# EAGLE schematic PCB (EAGLE 9.2.0)

## Sheet 1 of 5: PCB Power Regulation
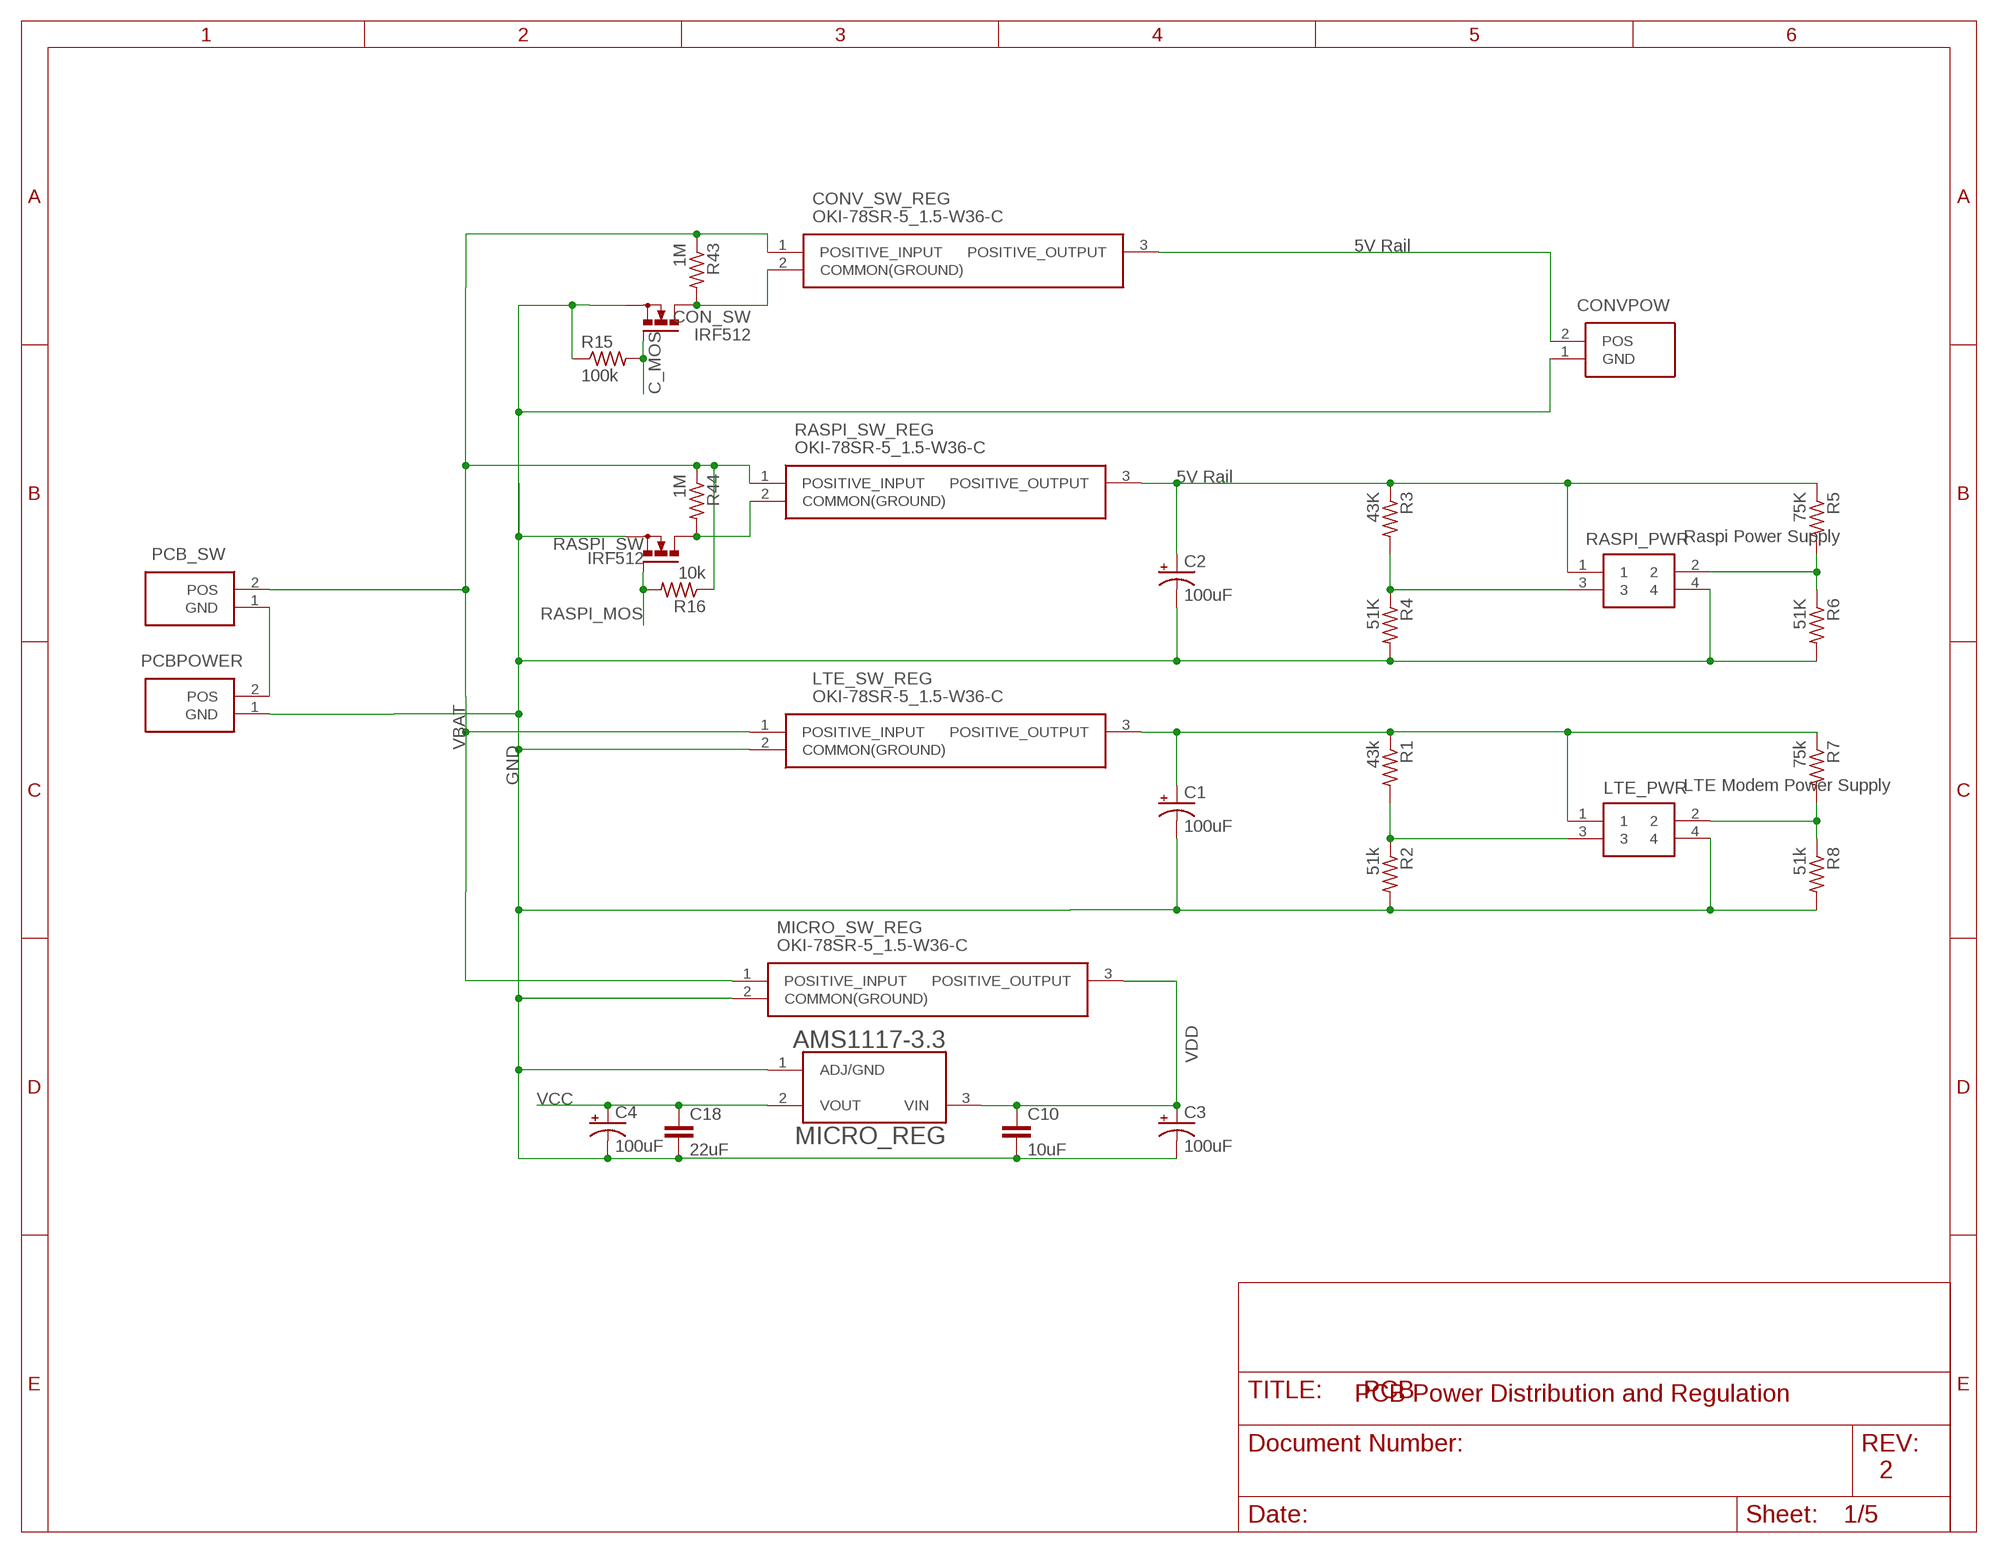
[diagram p0: schematic, sheet 1]
PCB (FRAME_A_L): REV: 2; TITLE: PCB Power Distribution and Regulation

### Parts
C1  100uF  CPOL-US140CLH-0810  [140CLH-0810]
C2  100uF  CPOL-US140CLH-0810  [140CLH-0810]
C3  100uF  CPOL-US140CLH-0810  [140CLH-0810]
C4  100uF  CPOL-US140CLH-0810  [140CLH-0810]
C10  10uF  C-EUC0805  [C0805]
C18  22uF  C-EUC0805  [C0805]
CON_SW  IRF512  [TO220BV]
CONV_SW_REG  OKI-78SR-5_1.5-W36-C  [OKI-78SR]
CONVPOW  PRT-10474  [SHDR2W320P716_1X2_1574X813X158]
LTE_PWR  LTE Modem Power Supply  105057-0001  [105057-0001]
LTE_SW_REG  OKI-78SR-5_1.5-W36-C  [OKI-78SR]
MICRO_REG  AMS1117-3.3  [SOT229P700X180-4N]
MICRO_SW_REG  OKI-78SR-5_1.5-W36-C  [OKI-78SR]
PCB_SW  PRT-10474  [SHDR2W320P716_1X2_1574X813X158]
PCBPOWER  PRT-10474  [SHDR2W320P716_1X2_1574X813X158]
R1  43k  R-US_R0805  [R0805]
R2  51k  R-US_R0805  [R0805]
R3  43K  R-US_R0805  [R0805]
R4  51K  R-US_R0805  [R0805]
R5  75K  R-US_R0805  [R0805]
R6  51K  R-US_R0805  [R0805]
R7  75k  R-US_R0805  [R0805]
R8  51k  R-US_R0805  [R0805]
R15  100k  R-US_R0805  [R0805]
R16  10k  R-US_R0805  [R0805]
R43  1M  R-US_R0805  [R0805]
R44  1M  R-US_R0805  [R0805]
RASPI_PWR  Raspi Power Supply  105057-0001  [105057-0001]
RASPI_SW  IRF512  [TO220BV]
RASPI_SW_REG  OKI-78SR-5_1.5-W36-C  [OKI-78SR]

### Nets
C_MOS: CON_SW.G R15.2 ; also sheet 3
GND [power]: C1.- C2.- C3.- C4.- C10.2 C18.2 CON_SW.S CONVPOW.1(GND) LTE_PWR.4 LTE_SW_REG.2(COMMON(GROUND)) MICRO_REG.1(ADJ/GND) MICRO_SW_REG.2(COMMON(GROUND)) PCBPOWER.1(GND) R2.2 R4.2 R6.2 R8.2 R15.1 RASPI_PWR.4 RASPI_SW.S ; also sheet 2,3,4
N$2 [power]: CONV_SW_REG.3(POSITIVE_OUTPUT) CONVPOW.2(POS)
N$6 [power]: C1.+ LTE_PWR.1 LTE_SW_REG.3(POSITIVE_OUTPUT) R1.1 R7.1
N$7 [power]: LTE_PWR.3 R1.2 R2.1
N$9 [power]: LTE_PWR.2 R7.2 R8.1
N$11 [power]: CON_SW.D CONV_SW_REG.2(COMMON(GROUND)) R43.2
N$13 [power]: R5.2 R6.1 RASPI_PWR.2
N$15 [power]: R3.2 R4.1 RASPI_PWR.3
N$16 [power]: C2.+ R3.1 R5.1 RASPI_PWR.1 RASPI_SW_REG.3(POSITIVE_OUTPUT)
N$19: R44.2 RASPI_SW.D RASPI_SW_REG.2(COMMON(GROUND))
N$52: PCB_SW.1(GND) PCBPOWER.2(POS)
RASPI_MOS: R16.2 RASPI_SW.G ; also sheet 3
VBAT [power]: CONV_SW_REG.1(POSITIVE_INPUT) LTE_SW_REG.1(POSITIVE_INPUT) MICRO_SW_REG.1(POSITIVE_INPUT) PCB_SW.2(POS) R16.1 R43.1 R44.1 RASPI_SW_REG.1(POSITIVE_INPUT)
VCC: C4.+ C18.1 MICRO_REG.2(VOUT) ; also sheet 3,4
VDD [power]: C3.+ C10.1 MICRO_REG.3(VIN) MICRO_SW_REG.3(POSITIVE_OUTPUT) ; also sheet 4

### Notes on the sheet
- 5V Rail
- 5V Rail

## Sheet 2 of 5: Onboard Charging Circuit
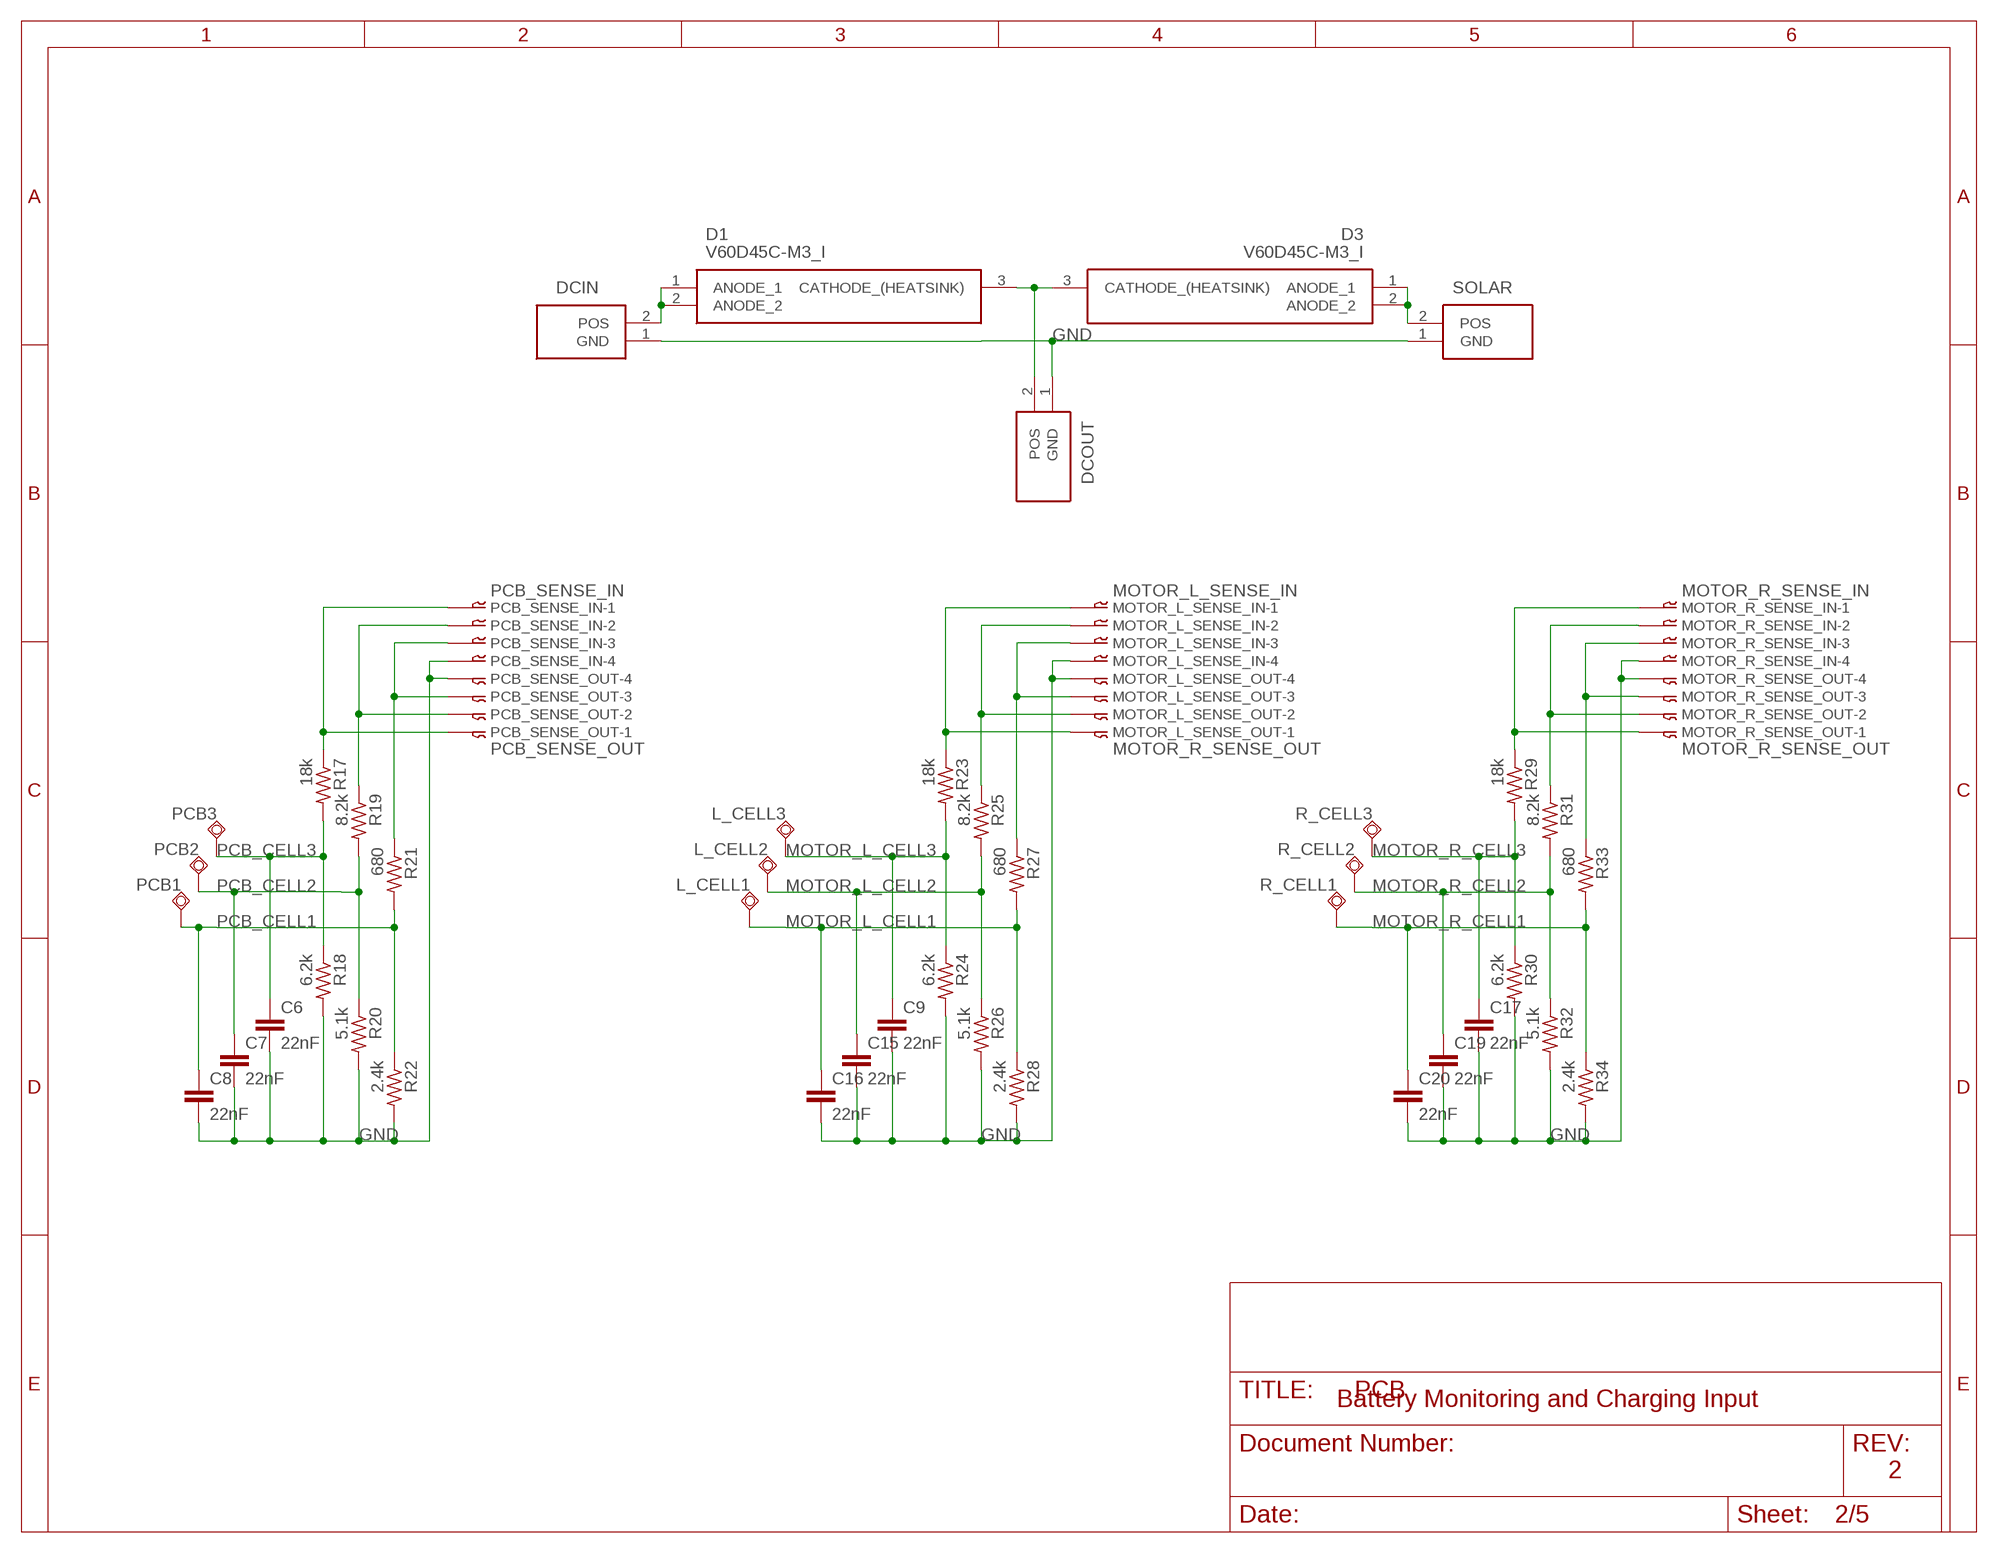
[diagram p1: schematic, sheet 2]
FRAME2 (FRAME_A_L): REVISION: 2; TITLE: Battery Monitoring and Charging Input

### Parts
C6  22nF  C  [C0805]
C7  22nF  C  [C0805]
C8  22nF  C  [C0805]
C9  22nF  C  [C0805]
C15  22nF  C  [C0805]
C16  22nF  C  [C0805]
C17  22nF  C  [C0805]
C19  22nF  C  [C0805]
C20  22nF  C  [C0805]
D1  V60D45C-M3_I  [TO-263AC(SMPD)]
D3  V60D45C-M3_I  [TO-263AC(SMPD)]
DCIN  PRT-10474  [SHDR2W320P716_1X2_1574X813X158]
DCOUT  PRT-10474  [SHDR2W320P716_1X2_1574X813X158]
L_CELL1  TPSQB2,54  [B2,54]
L_CELL2  TPSQB2,54  [B2,54]
L_CELL3  PCB_CELL3  TPSQB2,54  [B2,54]
MOTOR_L_SENSE_IN  MOTOR_L_SENSE_IN  04-JST-B4B-XH-A  [B4B-XH]
MOTOR_L_SENSE_OUT  MOTOR_R_SENSE_OUT  04-JST-B4B-XH-A  [B4B-XH]
MOTOR_R_SENSE_IN  MOTOR_R_SENSE_IN  04-JST-B4B-XH-A  [B4B-XH]
MOTOR_R_SENSE_OUT  MOTOR_R_SENSE_OUT  04-JST-B4B-XH-A  [B4B-XH]
PCB1  TPSQB2,54  [B2,54]
PCB2  TPSQB2,54  [B2,54]
PCB3  PCB_CELL3  TPSQB2,54  [B2,54]
PCB_SENSE_IN  PCB_SENSE_IN  04-JST-B4B-XH-A  [B4B-XH]
PCB_SENSE_OUT  PCB_SENSE_OUT  04-JST-B4B-XH-A  [B4B-XH]
R17  18k  R-US_R0805  [R0805]
R18  6.2k  R-US_R0805  [R0805]
R19  8.2k  R-US_R0805  [R0805]
R20  5.1k  R-US_R0805  [R0805]
R21  680  R-US_R0805  [R0805]
R22  2.4k  R-US_R0805  [R0805]
R23  18k  R-US_R0805  [R0805]
R24  6.2k  R-US_R0805  [R0805]
R25  8.2k  R-US_R0805  [R0805]
R26  5.1k  R-US_R0805  [R0805]
R27  680  R-US_R0805  [R0805]
R28  2.4k  R-US_R0805  [R0805]
R29  18k  R-US_R0805  [R0805]
R30  6.2k  R-US_R0805  [R0805]
R31  8.2k  R-US_R0805  [R0805]
R32  5.1k  R-US_R0805  [R0805]
R33  680  R-US_R0805  [R0805]
R34  2.4k  R-US_R0805  [R0805]
R_CELL1  TPSQB2,54  [B2,54]
R_CELL2  TPSQB2,54  [B2,54]
R_CELL3  PCB_CELL3  TPSQB2,54  [B2,54]
SOLAR  PRT-10474  [SHDR2W320P716_1X2_1574X813X158]

### Nets
GND [power]: C6.2 C7.2 C8.2 C9.2 C15.2 C16.2 C17.2 C19.2 C20.2 DCIN.1(GND) DCOUT.1(GND) MOTOR_L_SENSE_IN.P$4 MOTOR_L_SENSE_OUT.P$4 MOTOR_R_SENSE_IN.P$4 MOTOR_R_SENSE_OUT.P$4 PCB_SENSE_IN.P$4 PCB_SENSE_OUT.P$4 R18.2 R20.2 R22.2 R24.2 R26.2 R28.2 R30.2 R32.2 R34.2 SOLAR.1(GND) ; also sheet 1,3,4
MOTOR_L_CELL1: C16.1 L_CELL1.TP R27.2 R28.1 ; also sheet 3
MOTOR_L_CELL2: C15.1 L_CELL2.TP R25.2 R26.1 ; also sheet 3
MOTOR_L_CELL3: C9.1 L_CELL3.TP R23.2 R24.1 ; also sheet 3
MOTOR_R_CELL1: C20.1 R33.2 R34.1 R_CELL1.TP ; also sheet 3
MOTOR_R_CELL2: C19.1 R31.2 R32.1 R_CELL2.TP ; also sheet 3
MOTOR_R_CELL3: C17.1 R29.2 R30.1 R_CELL3.TP ; also sheet 3
N$1: PCB_SENSE_IN.P$3 PCB_SENSE_OUT.P$3 R21.1
N$4: D1.1(ANODE_1) D1.2(ANODE_2) DCIN.2(POS)
N$5: D3.1(ANODE_1) D3.2(ANODE_2) SOLAR.2(POS)
N$8: PCB_SENSE_IN.P$1 PCB_SENSE_OUT.P$1 R17.1
N$10: MOTOR_L_SENSE_IN.P$3 MOTOR_L_SENSE_OUT.P$3 R27.1
N$12: MOTOR_L_SENSE_IN.P$2 MOTOR_L_SENSE_OUT.P$2 R25.1
N$14: MOTOR_L_SENSE_IN.P$1 MOTOR_L_SENSE_OUT.P$1 R23.1
N$17: MOTOR_R_SENSE_IN.P$3 MOTOR_R_SENSE_OUT.P$3 R33.1
N$20: MOTOR_R_SENSE_IN.P$2 MOTOR_R_SENSE_OUT.P$2 R31.1
N$27: PCB_SENSE_IN.P$2 PCB_SENSE_OUT.P$2 R19.1
N$28: MOTOR_R_SENSE_IN.P$1 MOTOR_R_SENSE_OUT.P$1 R29.1
N$35: D1.3(CATHODE_(HEATSINK)) D3.3(CATHODE_(HEATSINK)) DCOUT.2(POS)
PCB_CELL1: C8.1 PCB1.TP R21.2 R22.1 ; also sheet 3
PCB_CELL2: C7.1 PCB2.TP R19.2 R20.1 ; also sheet 3
PCB_CELL3: C6.1 PCB3.TP R17.2 R18.1 ; also sheet 3

## Sheet 3 of 5: MCU Circuit
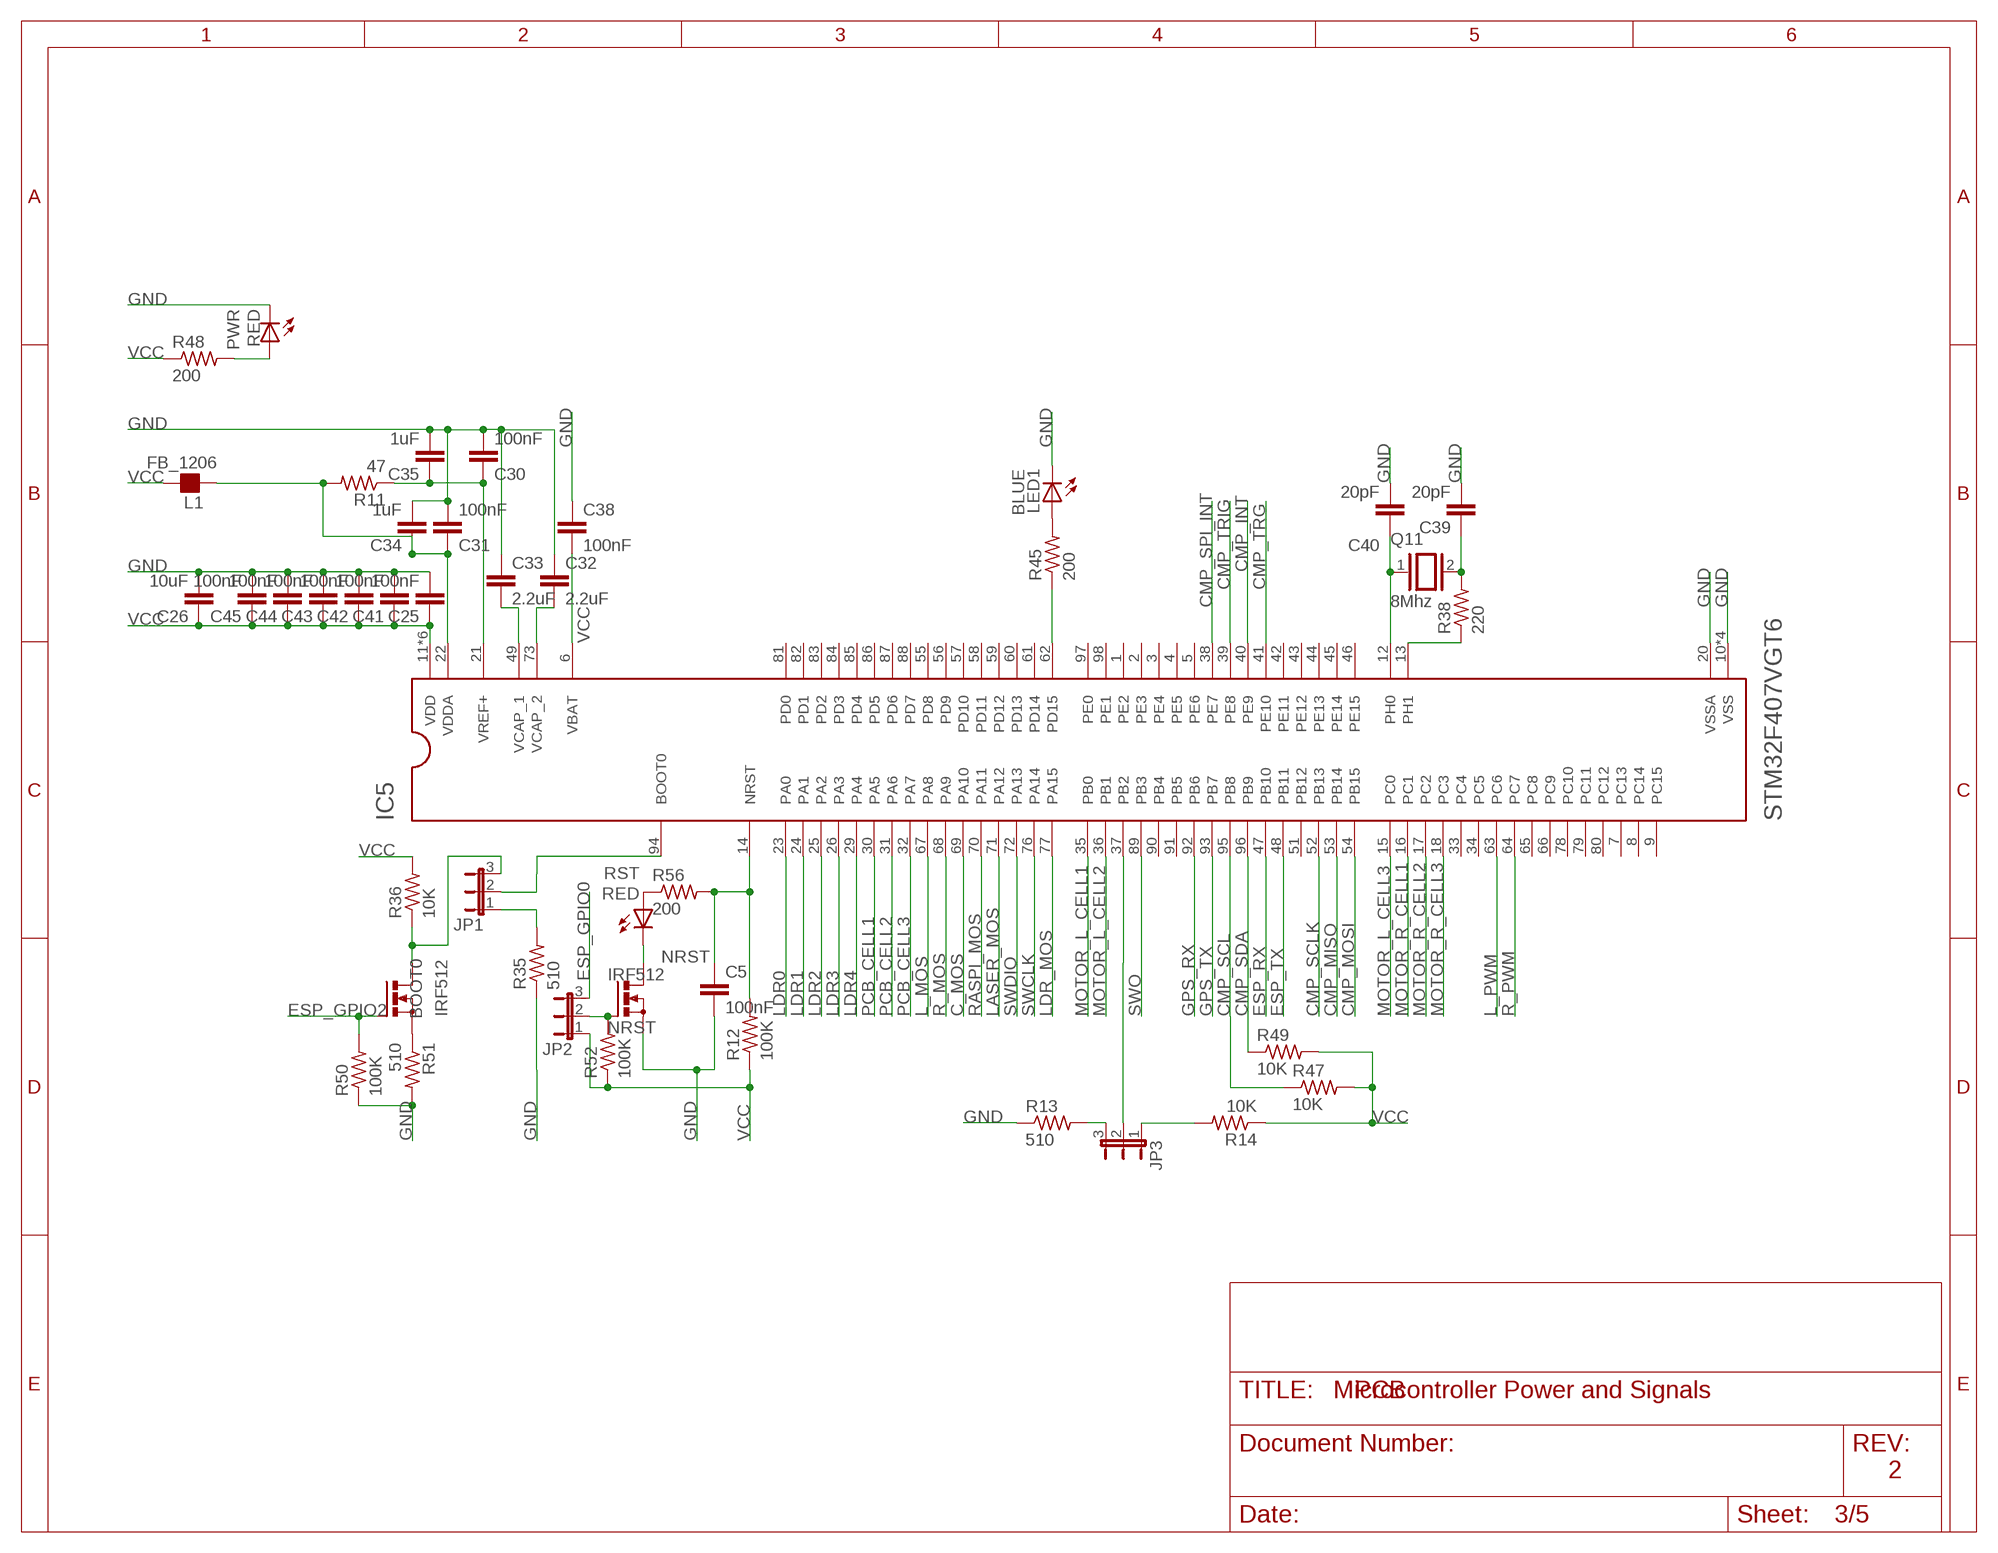
[diagram p2: schematic, sheet 3]
FRAME3 (FRAME_A_L): REV: 2; TITLE: Microcontroller Power and Signals

### Parts
BOOT0  IRF512  [TO220BV]
C5  100nF  C-EUC0805  [C0805]
C25  100nF  C-EUC0805  [C0805]
C26  10uF  C-EUC0805  [C0805]
C30  100nF  C-EUC0805  [C0805]
C31  100nF  C-EUC0805  [C0805]
C32  2.2uF  C-EUC0805  [C0805]
C33  2.2uF  C-EUC0805  [C0805]
C34  1uF  C-EUC0805  [C0805]
C35  1uF  C-EUC0805  [C0805]
C38  100nF  C-EUC0805  [C0805]
C39  20pF  C-EUC0805  [C0805]
C40  20pF  C-EUC0805  [C0805]
C41  100nF  C-EUC0805  [C0805]
C42  100nF  C-EUC0805  [C0805]
C43  100nF  C-EUC0805  [C0805]
C44  100nF  C-EUC0805  [C0805]
C45  100nF  C-EUC0805  [C0805]
IC5  STM32F407VGT6  [QFP50P1600X1600X160-100N]
JP1  JP2E  [JP2]
JP2  JP2E  [JP2]
JP3  JP2E  [JP2]
L1  FB_1206  [L1206]
LED1  BLUE  LEDCHIPLED_0805  [CHIPLED_0805]
NRST  IRF512  [TO220BV]
PWR  RED  LEDCHIPLED_0805  [CHIPLED_0805]
Q11  8Mhz  XTAL/S  [QS]
R11  47  R-US_R0805  [R0805]
R12  100K  R-US_R0805  [R0805]
R13  510  R-US_R0805  [R0805]
R14  10K  R-US_R0805  [R0805]
R35  510  R-US_R0805  [R0805]
R36  10K  R-US_R0805  [R0805]
R38  220  R-US_R0805  [R0805]
R45  200  R-US_R0805  [R0805]
R47  10K  R-US_R0805  [R0805]
R48  200  R-US_R0805  [R0805]
R49  10K  R-US_R0805  [R0805]
R50  100K  R-US_R0805  [R0805]
R51  510  R-US_R0805  [R0805]
R52  100K  R-US_R0805  [R0805]
R56  200  R-US_R0805  [R0805]
RST  RED  LEDCHIPLED_0805  [CHIPLED_0805]

### Nets
C_MOS: IC5.69(PA10) ; also sheet 1
CMP_INT: IC5.40(PE9) ; also sheet 4
CMP_MISO: IC5.53(PB14) ; also sheet 4
CMP_MOSI: IC5.54(PB15) ; also sheet 4
CMP_SCL: IC5.95(PB8) R47.1 ; also sheet 4
CMP_SCLK: IC5.52(PB13) ; also sheet 4
CMP_SDA: IC5.96(PB9) R49.1 ; also sheet 4
CMP_SPI_INT: IC5.38(PE7) ; also sheet 4
CMP_TRG: IC5.41(PE10) ; also sheet 4
CMP_TRIG: IC5.39(PE8) ; also sheet 4
ESP_GPIO0: JP2.3 ; also sheet 4
ESP_GPIO2: BOOT0.G R50.2 ; also sheet 4
ESP_RX: IC5.47(PB10) ; also sheet 4
ESP_TX: IC5.48(PB11) ; also sheet 4
GND [power]: C5.2 C25.2 C26.2 C30.2 C31.2 C32.1 C33.1 C34.2 C35.2 C38.1 C39.2 C40.2 C41.2 C42.2 C43.2 C44.2 C45.2 IC5.10(VSS) IC5.20(VSSA) IC5.27(VSS) IC5.74(VSS) IC5.99(VSS) LED1.C NRST.S PWR.C R13.1 R35.1 R50.1 R51.2 ; also sheet 1,2,4
GPS_RX: IC5.92(PB6) ; also sheet 4
GPS_TX: IC5.93(PB7) ; also sheet 4
L_MOS: IC5.67(PA8) ; also sheet 4
L_PWM: IC5.63(PC6) ; also sheet 4
LASER_MOS: IC5.71(PA12) ; also sheet 4
LDR0: IC5.23(PA0) ; also sheet 4
LDR1: IC5.24(PA1) ; also sheet 4
LDR2: IC5.25(PA2) ; also sheet 4
LDR3: IC5.26(PA3) ; also sheet 4
LDR4: IC5.29(PA4) ; also sheet 4
LDR_MOS: IC5.77(PA15) ; also sheet 4
MOTOR_L_CELL1: IC5.35(PB0) ; also sheet 2
MOTOR_L_CELL2: IC5.36(PB1) ; also sheet 2
MOTOR_L_CELL3: IC5.15(PC0) ; also sheet 2
MOTOR_R_CELL1: IC5.16(PC1) ; also sheet 2
MOTOR_R_CELL2: IC5.17(PC2) ; also sheet 2
MOTOR_R_CELL3: IC5.18(PC3) ; also sheet 2
N$3: IC5.37(PB2) JP3.2
N$23: C32.2 IC5.73(VCAP_2)
N$34: R56.1 RST.A
N$36: C33.2 IC5.49(VCAP_1)
N$37: PWR.A R48.2
N$38: JP3.1 R14.2
N$39: C30.1 C35.1 IC5.21(VREF+) R11.1
N$40: C31.1 C34.1 IC5.22(VDDA) L1.1 R11.2
N$43: IC5.62(PD15) R45.1
N$44: JP2.2 NRST.G R52.2
N$45: BOOT0.S R51.1
N$50: LED1.A R45.2
N$63: C5.1 IC5.14(NRST) R12.2 R56.2
N$65: IC5.13(PH1) R38.1
N$66: IC5.94(BOOT0) JP1.2
N$67: JP1.1 R35.2
N$68: C39.1 Q11.2 R38.2
N$69: BOOT0.D JP1.3 R36.1
N$70: C40.1 IC5.12(PH0) Q11.1
N$83: JP3.3 R13.2
NRST: NRST.D RST.C ; also sheet 4
PCB_CELL1: IC5.30(PA5) ; also sheet 2
PCB_CELL2: IC5.31(PA6) ; also sheet 2
PCB_CELL3: IC5.32(PA7) ; also sheet 2
R_MOS: IC5.68(PA9) ; also sheet 4
R_PWM: IC5.64(PC7) ; also sheet 4
RASPI_MOS: IC5.70(PA11) ; also sheet 1
SWCLK: IC5.76(PA14) ; also sheet 4
SWDIO: IC5.72(PA13) ; also sheet 4
SWO: IC5.89(PB3) ; also sheet 4
VCC: C25.1 C26.1 C38.2 C41.1 C42.1 C43.1 C44.1 C45.1 IC5.6(VBAT) IC5.11(VDD) IC5.19(VDD) IC5.28(VDD) IC5.50(VDD) IC5.75(VDD) IC5.100(VDD) JP2.1 L1.2 R12.1 R14.1 R36.2 R47.2 R48.1 R49.2 R52.1 ; also sheet 1,4
Unconnected: IC5.1(PE2) IC5.2(PE3) IC5.3(PE4) IC5.4(PE5) IC5.5(PE6) IC5.7(PC13) IC5.8(PC14) IC5.9(PC15) IC5.33(PC4) IC5.34(PC5) IC5.42(PE11) IC5.43(PE12) IC5.44(PE13) IC5.45(PE14) IC5.46(PE15) IC5.51(PB12) IC5.55(PD8) IC5.56(PD9) IC5.57(PD10) IC5.58(PD11) IC5.59(PD12) IC5.60(PD13) IC5.61(PD14) IC5.65(PC8) IC5.66(PC9) IC5.78(PC10) IC5.79(PC11) IC5.80(PC12) IC5.81(PD0) IC5.82(PD1) IC5.83(PD2) IC5.84(PD3) IC5.85(PD4) IC5.86(PD5) IC5.87(PD6) IC5.88(PD7) IC5.90(PB4) IC5.91(PB5) IC5.97(PE0) IC5.98(PE1)

## Sheet 4 of 5: Signal Circuit
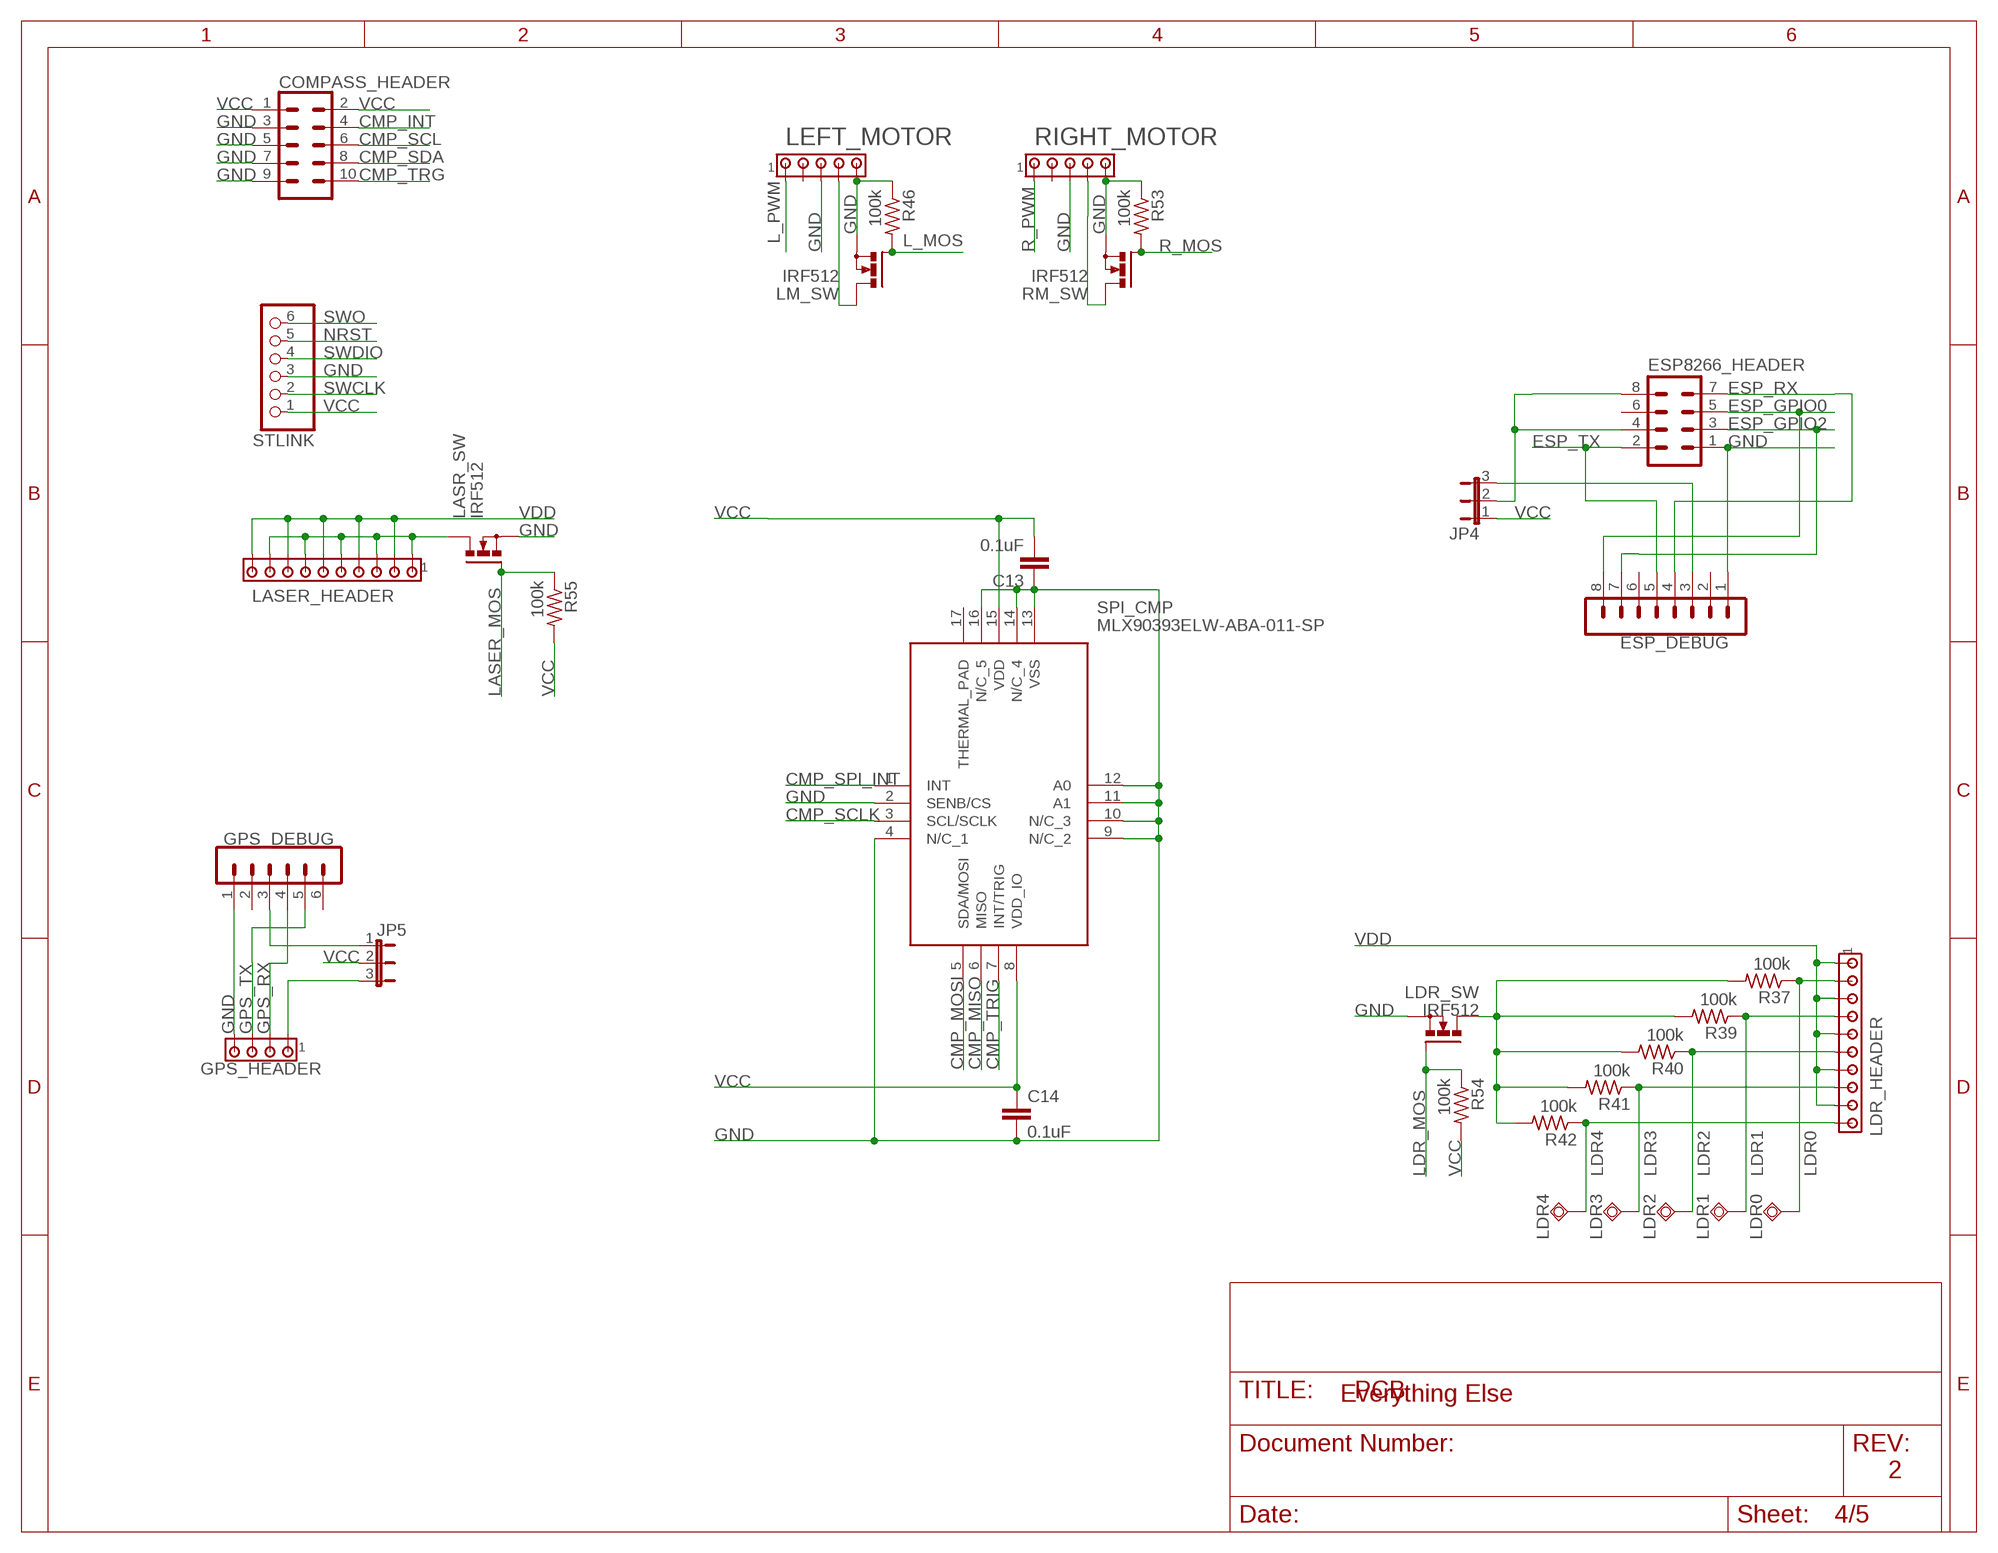
[diagram p3: schematic, sheet 4]
FRAME5 (FRAME_A_L): REV: 2; TITLE: Everything Else

### Parts
C13  0.1uF  C-EUC1206  [C1206]
C14  0.1uF  C-EUC1206  [C1206]
COMPASS_HEADER  CONN_05X2SHD  [2X5-SHROUDED]
ESP8266_HEADER  MA04-2  [MA04-2]
ESP_DEBUG  MA08-1  [MA08-1]
GPS_DEBUG  MA06-1  [MA06-1]
GPS_HEADER  MTA04-100  [10X04MTA]
JP4  JP2E  [JP2]
JP5  JP2E  [JP2]
LASER_HEADER  MTA10-100  [10X10MTA]
LASR_SW  IRF512  [TO220BV]
LDR0  TPSQB2,54  [B2,54]
LDR1  TPSQB2,54  [B2,54]
LDR2  TPSQB2,54  [B2,54]
LDR3  TPSQB2,54  [B2,54]
LDR4  TPSQB2,54  [B2,54]
LDR_HEADER  MTA10-100  [10X10MTA]
LDR_SW  IRF512  [TO220BV]
LEFT_MOTOR  MTA05-100  [1X05MTA]
LM_SW  IRF512  [TO220BV]
R37  100k  R-US_R1206  [R1206]
R39  100k  R-US_R1206  [R1206]
R40  100k  R-US_R1206  [R1206]
R41  100k  R-US_R1206  [R1206]
R42  100k  R-US_R1206  [R1206]
R46  100k  R-US_R1206  [R1206]
R53  100k  R-US_R1206  [R1206]
R54  100k  R-US_R1206  [R1206]
R55  100k  R-US_R1206  [R1206]
RIGHT_MOTOR  MTA05-100  [1X05MTA]
RM_SW  IRF512  [TO220BV]
SPI_CMP  MLX90393ELW-ABA-011-SP  [QFN50P300X300X100-17N]
STLINK  PINHD-1X6  [1X06]

### Nets
CMP_INT: COMPASS_HEADER.4 ; also sheet 3
CMP_MISO: SPI_CMP.6(MISO) ; also sheet 3
CMP_MOSI: SPI_CMP.5(SDA/MOSI) ; also sheet 3
CMP_SCL: COMPASS_HEADER.6 ; also sheet 3
CMP_SCLK: SPI_CMP.3(SCL/SCLK) ; also sheet 3
CMP_SDA: COMPASS_HEADER.8 ; also sheet 3
CMP_SPI_INT: SPI_CMP.1(INT) ; also sheet 3
CMP_TRG: COMPASS_HEADER.10 ; also sheet 3
CMP_TRIG: SPI_CMP.7(INT/TRIG) ; also sheet 3
ESP_GPIO0: ESP8266_HEADER.5 ESP_DEBUG.8 ; also sheet 3
ESP_GPIO2: ESP8266_HEADER.3 ESP_DEBUG.7 ; also sheet 3
ESP_RX: ESP8266_HEADER.7 ESP_DEBUG.4 ; also sheet 3
ESP_TX: ESP8266_HEADER.2 ESP_DEBUG.5 ; also sheet 3
GND [power]: C13.1 C14.2 COMPASS_HEADER.3 COMPASS_HEADER.5 COMPASS_HEADER.7 COMPASS_HEADER.9 ESP8266_HEADER.1 ESP_DEBUG.1 GPS_DEBUG.1 GPS_HEADER.4 LASR_SW.S LDR_SW.S LEFT_MOTOR.3 LEFT_MOTOR.5 LM_SW.S R46.1 R53.1 RIGHT_MOTOR.3 RIGHT_MOTOR.5 RM_SW.S SPI_CMP.2(SENB/CS) SPI_CMP.4(N/C_1) SPI_CMP.9(N/C_2) SPI_CMP.10(N/C_3) SPI_CMP.11(A1) SPI_CMP.12(A0) SPI_CMP.13(VSS) SPI_CMP.14(N/C_4) SPI_CMP.16(N/C_5) STLINK.3 ; also sheet 1,2,3
GPS_RX: GPS_DEBUG.4 GPS_HEADER.2 ; also sheet 3
GPS_TX: GPS_DEBUG.5 GPS_HEADER.3 ; also sheet 3
L_MOS: LM_SW.G R46.2 ; also sheet 3
L_PWM: LEFT_MOTOR.1 ; also sheet 3
LASER_MOS: LASR_SW.G R55.1 ; also sheet 3
LDR0: LDR0.TP LDR_HEADER.2 R37.1 ; also sheet 3
LDR1: LDR1.TP LDR_HEADER.4 R39.1 ; also sheet 3
LDR2: LDR2.TP LDR_HEADER.6 R40.1 ; also sheet 3
LDR3: LDR3.TP LDR_HEADER.8 R41.1 ; also sheet 3
LDR4: LDR4.TP LDR_HEADER.10 R42.1 ; also sheet 3
LDR_MOS: LDR_SW.G R54.1 ; also sheet 3
N$26: LEFT_MOTOR.4 LM_SW.D
N$41: ESP_DEBUG.3 JP4.3
N$46: GPS_DEBUG.3 JP5.1
N$47 [power]: LDR_SW.D R37.2 R39.2 R40.2 R41.2 R42.2
N$48: ESP8266_HEADER.4 ESP8266_HEADER.8 JP4.2
N$49: GPS_HEADER.1 JP5.3
N$51: LASER_HEADER.1 LASER_HEADER.3 LASER_HEADER.5 LASER_HEADER.7 LASER_HEADER.9 LASR_SW.D
N$73: RIGHT_MOTOR.4 RM_SW.D
NRST: STLINK.5 ; also sheet 3
R_MOS: R53.2 RM_SW.G ; also sheet 3
R_PWM: RIGHT_MOTOR.1 ; also sheet 3
SWCLK: STLINK.2 ; also sheet 3
SWDIO: STLINK.4 ; also sheet 3
SWO: STLINK.6 ; also sheet 3
VCC: C13.2 C14.1 COMPASS_HEADER.1 COMPASS_HEADER.2 JP4.1 JP5.2 R54.2 R55.2 SPI_CMP.8(VDD_IO) SPI_CMP.15(VDD) STLINK.1 ; also sheet 1,3
VDD [power]: LASER_HEADER.2 LASER_HEADER.4 LASER_HEADER.6 LASER_HEADER.8 LASER_HEADER.10 LDR_HEADER.1 LDR_HEADER.3 LDR_HEADER.5 LDR_HEADER.7 LDR_HEADER.9 ; also sheet 1
Unconnected: ESP8266_HEADER.6 ESP_DEBUG.2 ESP_DEBUG.6 GPS_DEBUG.2 GPS_DEBUG.6 LEFT_MOTOR.2 RIGHT_MOTOR.2 SPI_CMP.17(THERMAL_PAD)

## Sheet 5 of 5: Compass Daughter Board
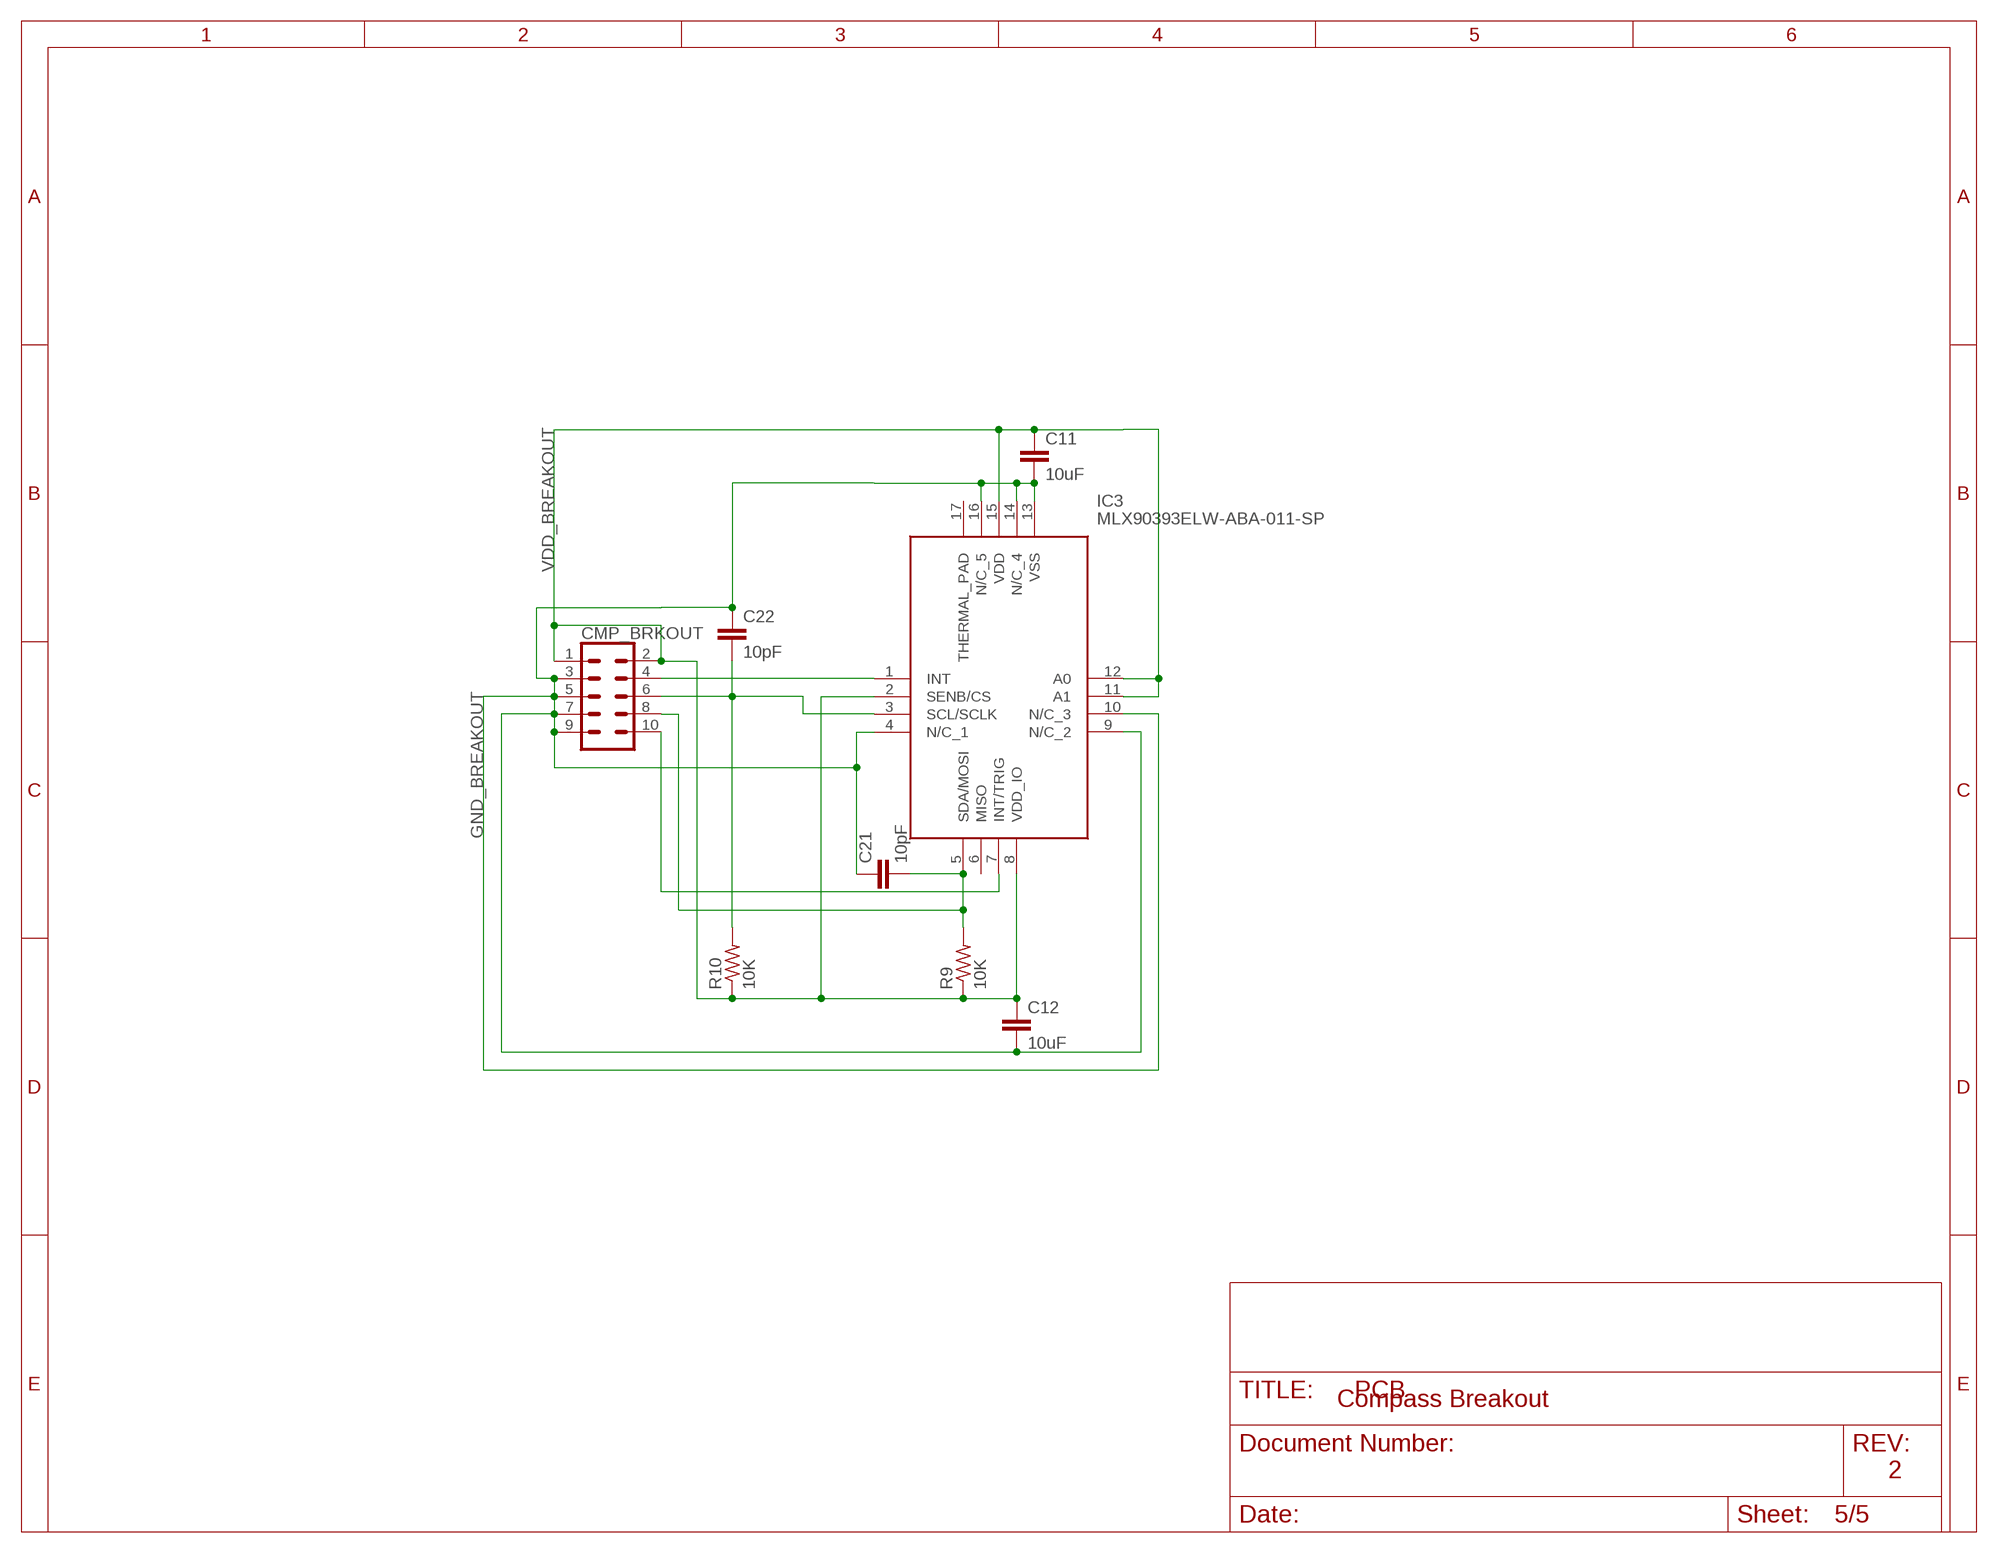
[diagram p4: schematic, sheet 5]
FRAME6 (FRAME_A_L): REV: 2; TITLE: Compass Breakout

### Parts
C11  10uF  C-EUC1206  [C1206]
C12  10uF  C-EUC1206  [C1206]
C21  10pF  C-EUC1206  [C1206]
C22  10pF  C-EUC1206  [C1206]
CMP_BRKOUT  CONN_05X2SHD  [2X5-SHROUDED]
IC3  MLX90393ELW-ABA-011-SP  [QFN50P300X300X100-17N]
R9  10K  R-US_R1206  [R1206]
R10  10K  R-US_R1206  [R1206]

### Nets
GND_BREAKOUT: C11.2 C12.2 C21.1 C22.1 CMP_BRKOUT.3 CMP_BRKOUT.5 CMP_BRKOUT.7 CMP_BRKOUT.9 IC3.4(N/C_1) IC3.9(N/C_2) IC3.10(N/C_3) IC3.13(VSS) IC3.14(N/C_4) IC3.16(N/C_5)
N$22: CMP_BRKOUT.4 IC3.1(INT)
N$24: C22.2 CMP_BRKOUT.6 IC3.3(SCL/SCLK) R10.2
N$25: C21.2 CMP_BRKOUT.8 IC3.5(SDA/MOSI) R9.2
N$29: CMP_BRKOUT.10 IC3.7(INT/TRIG)
VDD_BREAKOUT: C11.1 C12.1 CMP_BRKOUT.1 CMP_BRKOUT.2 IC3.2(SENB/CS) IC3.8(VDD_IO) IC3.11(A1) IC3.12(A0) IC3.15(VDD) R9.1 R10.1
Unconnected: IC3.6(MISO) IC3.17(THERMAL_PAD)

## Library data of the parts
BOOT0 CON_SW LASR_SW LDR_SW LM_SW NRST RASPI_SW RM_SW = transistor-power:IRF512: N-CHANNEL MOS FET
C1-C4 = rcl:CPOL-US: POLARIZED CAPACITOR, American symbol; SPICEPREFIX: C
C5 C25 C26 C30-C35 C38-C45 = rcl:C-EU: CAPACITOR, European symbol; SPICEPREFIX: C
C6-C9 C15-C17 C19 C20 = eagle-ltspice:C: CAPACITOR, European symbol; SPICEMODEL: NONE; SPICEPREFIX: C
C10-C14 C18 C21 C22 = resistor:C-EU: CAPACITOR, European symbol
CMP_BRKOUT COMPASS_HEADER = SparkFun-Connectors:CONN_05X2: Multi connection point. Often used as Generic Header-pin footprint for 0.1 inch spaced/style header connections For AVR SPI programming port, see special device with nice symbol: "AVR_SPI_PROG_5x2.dev" You can populate with any combo of single row headers, but if you'd like an exact match, check these: 2x5 AVR ICSP Male Header <https://www.sparkfun.com/products/778> (PRT-00778) 2x5 Pin Shrouded Header <https://www.sparkfun.com/products/8506> (PRT-08506) On any of the 0.1 inch spaced packages, you can populate with these: Break Away Headers - Straight <https://www.sparkfun.com/products/116> (PRT-00116) Break Away Male Headers - Right Angle <https://www.sparkfun.com/products/553> (PRT-00553) Female Headers <https://www.sparkfun.com/products/115> (PRT-00115) Break Away Headers - Machine Pin <https://www.sparkfun.com/products/117> (PRT-00117) Break Away Female Headers - Swiss Machine Pin <https://www.sparkfun.com/products/743> (PRT-00743) Special note: the shrouded connector mates well with our 5x2 ribbon cables: 2x5 Pin IDC Ribbon Cable <https://www.sparkfun.com/products/8535> (PRT-08535); PROD_ID: CONN-08671; SF_ID: PRT-08506
CONV_SW_REG LTE_SW_REG MICRO_SW_REG RASPI_SW_REG = OKI-78SR-5_1.5-W36-C:OKI-78SR-5_1.5-W36-C: Non-Isolated DC/DC Converters 7.5W 24Vin 5Vout1 1.5A SIP Non-Iso Source: Datasheet <http://docs-europe.electrocomponents.com/webdocs/13d7/0900766b813d7b66.pdf>; ARROW_PART_NUMBER: OKI-78SR-5/1.5-W36-C; ARROW_PRICE-STOCK: https://www.arrow.com/en/products/oki-78sr-51.5-w36-c/murata-power-solutions; DESCRIPTION: Non-Isolated DC/DC Converters 7.5W 24Vin 5Vout1 1.5A SIP Non-Iso; HEIGHT: mm; MANUFACTURER_NAME: Murata Electronics; MANUFACTURER_PART_NUMBER: OKI-78SR-5/1.5-W36-C; RS_PART_NUMBER: 1736928; RS_PRICE-STOCK: http://uk.rs-online.com/web/p/products/1736928
CONVPOW DCIN DCOUT PCB_SW PCBPOWER SOLAR = PRT-10474:PRT-10474: Soldering Workstation Equipment XT60 Connectors Male/Female Pair Source: Datasheet <http://cdn.sparkfun.com/datasheets/Prototyping/xt60.pdf>; ARROW_PART_NUMBER: PRT-10474; DESCRIPTION: Soldering Workstation Equipment XT60 Connectors Male/Female Pair; HEIGHT: 15.875mm; MANUFACTURER_NAME: SparkFun; MANUFACTURER_PART_NUMBER: PRT-10474
D1 D3 = V60D45C-M3_I:V60D45C-M3_I: Vishay V60D45C-M3/I, Dual SMT Schottky Diode, Common Cathode, 45V 60A, 2-Pin TO-263AC Source: Datasheet <http://uk.rs-online.com/web/p/products/8321024>; ARROW_PART_NUMBER: V60D45C-M3/I; ARROW_PRICE-STOCK: https://www.arrow.com/en/products/v60d45c-m3i/vishay; DESCRIPTION: Vishay V60D45C-M3/I, Dual SMT Schottky Diode, Common Cathode, 45V 60A, 2-Pin TO-263AC; HEIGHT: mm; MANUFACTURER_NAME: Vishay; MANUFACTURER_PART_NUMBER: V60D45C-M3/I; RS_PART_NUMBER: 8321024; RS_PRICE-STOCK: http://uk.rs-online.com/web/p/products/8321024
ESP8266_HEADER = con-lstb:MA04-2: PIN HEADER; OC_FARNELL: unknown; OC_NEWARK: unknown
ESP_DEBUG = con-lstb:MA08-1: PIN HEADER; OC_FARNELL: unknown; OC_NEWARK: unknown
GPS_DEBUG = con-lstb:MA06-1: PIN HEADER; OC_FARNELL: unknown; OC_NEWARK: unknown
GPS_HEADER = con-amp:MTA04-100: AMP connector
IC3 SPI_CMP = MLX90393ELW-ABA-011-SP:MLX90393ELW-ABA-011-SP: Board Mount Hall Effect / Magnetic Sensors Triaxis Micropower Magnetometer Source: Datasheet <https://www.melexis.com/-/media/files/documents/datasheets/mlx90393-datasheet-melexis.pdf>; ARROW_PART_NUMBER: MLX90393ELW-ABA-011-SP; DESCRIPTION: Board Mount Hall Effect / Magnetic Sensors Triaxis Micropower Magnetometer; HEIGHT: 1mm; MANUFACTURER_NAME: Melexis; MANUFACTURER_PART_NUMBER: MLX90393ELW-ABA-011-SP
IC5 = STM32F407VGT6:STM32F407VGT6: STM32 Series 32-bit 1 MB Flash 192 kB RAM ARM Based Microcontroller - LQFP-100; AVAILABILITY: Unavailable; DESCRIPTION: STM32 Series 32-bit 1 MB Flash 192 kB RAM ARM Based Microcontroller - LQFP-100; MF: STMicroelectronics; MP: STM32F407VGT6; PACKAGE: LQFP-100 STMicroelectronics; PRICE: None
JP1-JP5 = jumper:JP2E: JUMPER
L1 = rc-master-smd:FB_: FERRITE BEAD
L_CELL1-L_CELL3 LDR0 LDR1-LDR4 PCB1-PCB3 R_CELL1-R_CELL3 = testpad:TPSQ: Test pad
LASER_HEADER LDR_HEADER = con-amp:MTA10-100: AMP connector
LED1 PWR RST = led:LED: LED OSRAM: - CHIPLED LG R971, LG N971, LY N971, LG Q971, LY Q971, LO R971, LY R971 LH N974, LH R974 LS Q976, LO Q976, LY Q976 LO Q996 - Hyper CHIPLED LW Q18S LB Q993, LB Q99A, LB R99A - SideLED LS A670, LO A670, LY A670, LG A670, LP A670 LB A673, LV A673, LT A673, LW A673 LH A674 LY A675 LS A676, LA A676, LO A676, LY A676, LW A676 LS A679, LY A679, LG A679 - Hyper Micro SIDELED® LS Y876, LA Y876, LO Y876, LY Y876 LT Y87S - SmartLED LW L88C, LW L88S LB L89C, LB L89S, LG L890 LS L89K, LO L89K, LY L89K LS L896, LA L896, LO L896, LY L896 - TOPLED LS T670, LO T670, LY T670, LG T670, LP T670 LSG T670, LSP T670, LSY T670, LOP T670, LYG T670 LG T671, LOG T671, LSG T671 LB T673, LV T673, LT T673, LW T673 LH T674 LS T676, LA T676, LO T676, LY T676, LB T676, LH T676, LSB T676, LW T676 LB T67C, LV T67C, LT T67C, LS T67K, LO T67K, LY T67K, LW E67C LS E67B, LA E67B, LO E67B, LY E67B, LB E67C, LV E67C, LT E67C LW T67C LS T679, LY T679, LG T679 LS T770, LO T770, LY T770, LG T770, LP T770 LB T773, LV T773, LT T773, LW T773 LH T774 LS E675, LA E675, LY E675, LS T675 LS T776, LA T776, LO T776, LY T776, LB T776 LHGB T686 LT T68C, LB T68C - Hyper Mini TOPLED® LB M676 - Mini TOPLED Santana® LG M470 LS M47K, LO M47K, LY M47K Source: http://www.osram.convergy.de LUXEON: - LUMILED® LXK2-PW12-R00, LXK2-PW12-S00, LXK2-PW14-U00, LXK2-PW14-V00 LXK2-PM12-R00, LXK2-PM12-S00, LXK2-PM14-U00 LXK2-PE12-Q00, LXK2-PE12-R00, LXK2-PE12-S00, LXK2-PE14-T00, LXK2-PE14-U00 LXK2-PB12-K00, LXK2-PB12-L00, LXK2-PB12-M00, LXK2-PB14-N00, LXK2-PB14-P00, LXK2-PB14-Q00 LXK2-PR12-L00, LXK2-PR12-M00, LXK2-PR14-Q00, LXK2-PR14-R00 LXK2-PD12-Q00, LXK2-PD12-R00, LXK2-PD12-S00 LXK2-PH12-R00, LXK2-PH12-S00 LXK2-PL12-P00, LXK2-PL12-Q00, LXK2-PL12-R00 Source: www.luxeon.com KINGBRIGHT: KA-3528ASYC Source: www.kingbright.com
LEFT_MOTOR RIGHT_MOTOR = AMP_MTA:MTA05-100
LTE_PWR RASPI_PWR = MOLEX_USB:105057-0001: Type A 2.0mm shielded USB PCB receptacle Molex 105057 Series, Vertical Version 2.0 Type A USB Connector, Through Hole Socket, 30 V, 1.5A Source: Datasheet <http://www.mouser.com/ds/2/276/1050570001_IO_CONNECTORS-230448.pdf>; ALLIED_NUMBER: 70747080; ALLIED_PRICE-STOCK: https://www.alliedelec.com/molex-incorporated-105057-0001/70747080/; ARROW_PART_NUMBER: 105057-0001; ARROW_PRICE-STOCK: http://uk.rs-online.com/web/p/products/8967579; DESCRIPTION: Type A 2.0mm shielded USB PCB receptacle Molex 105057 Series, Vertical Version 2.0 Type A USB Connector, Through Hole Socket, 30 V, 1.5A; HEIGHT: mm; MANUFACTURER_NAME: Molex; MANUFACTURER_PART_NUMBER: 105057-0001; RS_PART_NUMBER: 8967579; RS_PRICE-STOCK: http://uk.rs-online.com/web/p/products/8967579
MICRO_REG = AMS1117-3.3:AMS1117-3.3: Sot223/Pkg 1-Amp 3.3-Volt Low Drop Out Voltage Regulatator; AVAILABILITY: Unavailable; DESCRIPTION: Sot223/Pkg 1-Amp 3.3-Volt Low Drop Out Voltage Regulatator; MF: Advanced Monolithic Systems; MP: AMS1117-3.3; PACKAGE: None; PRICE: None
MOTOR_L_SENSE_IN MOTOR_L_SENSE_OUT MOTOR_R_SENSE_IN MOTOR_R_SENSE_OUT PCB_SENSE_IN PCB_SENSE_OUT = bt_con-jst-xh:04-JST: JST CONNECTOR
Q11 = special:XTAL/S: CRYSTAL
R1-R10 R15-R34 R37 R39-R44 R46 R53-R55 = resistor:R-US_: RESISTOR, American symbol
R11-R14 R35 R36 R38 R45 R47-R52 R56 = rcl:R-US_: RESISTOR, American symbol; SPICEPREFIX: R
STLINK = pinhead:PINHD-1X6: PIN HEADER

## Net classes
0 default: width 0.254 mm